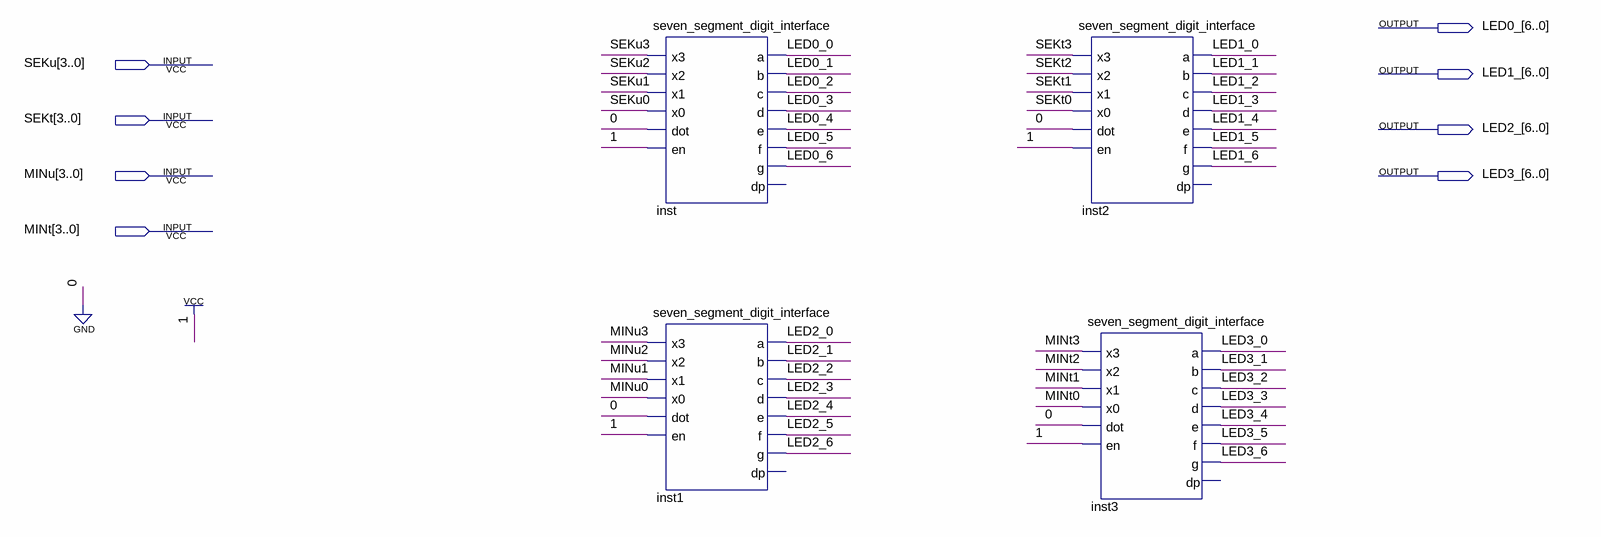
[diagram p0: schematic sheet]
// Quartus schematic ledovanje.bdf as structural Verilog: 4 symbols, 8 pins
module ledovanje (
  input  [3:0] SEKu,
  input  [3:0] SEKt,
  input  [3:0] MINu,
  input  [3:0] MINt,
  output [6:0] LED0_,
  output [6:0] LED1_,
  output [6:0] LED2_,
  output [6:0] LED3_
);

  seven_segment_digit_interface inst (
    .x3(SEKu[3]), .x2(SEKu[2]), .x1(SEKu[1]), .x0(SEKu[0]), .dot(1'b0), .en(1'b1), .a(LED0_[0]),
    .b(LED0_[1]), .c(LED0_[2]), .d(LED0_[3]), .e(LED0_[4]), .f(LED0_[5]), .g(LED0_[6]));  // open: dp
  seven_segment_digit_interface inst1 (
    .x3(MINu[3]), .x2(MINu[2]), .x1(MINu[1]), .x0(MINu[0]), .dot(1'b0), .en(1'b1), .a(LED2_[0]),
    .b(LED2_[1]), .c(LED2_[2]), .d(LED2_[3]), .e(LED2_[4]), .f(LED2_[5]), .g(LED2_[6]));  // open: dp
  seven_segment_digit_interface inst2 (
    .x3(SEKt[3]), .x2(SEKt[2]), .x1(SEKt[1]), .x0(SEKt[0]), .dot(1'b0), .en(1'b1), .a(LED1_[0]),
    .b(LED1_[1]), .c(LED1_[2]), .d(LED1_[3]), .e(LED1_[4]), .f(LED1_[5]), .g(LED1_[6]));  // open: dp
  seven_segment_digit_interface inst3 (
    .x3(MINt[3]), .x2(MINt[2]), .x1(MINt[1]), .x0(MINt[0]), .dot(1'b0), .en(1'b1), .a(LED3_[0]),
    .b(LED3_[1]), .c(LED3_[2]), .d(LED3_[3]), .e(LED3_[4]), .f(LED3_[5]), .g(LED3_[6]));  // open: dp
endmodule
